# EAGLE design btle_board (EAGLE 6.6.0)
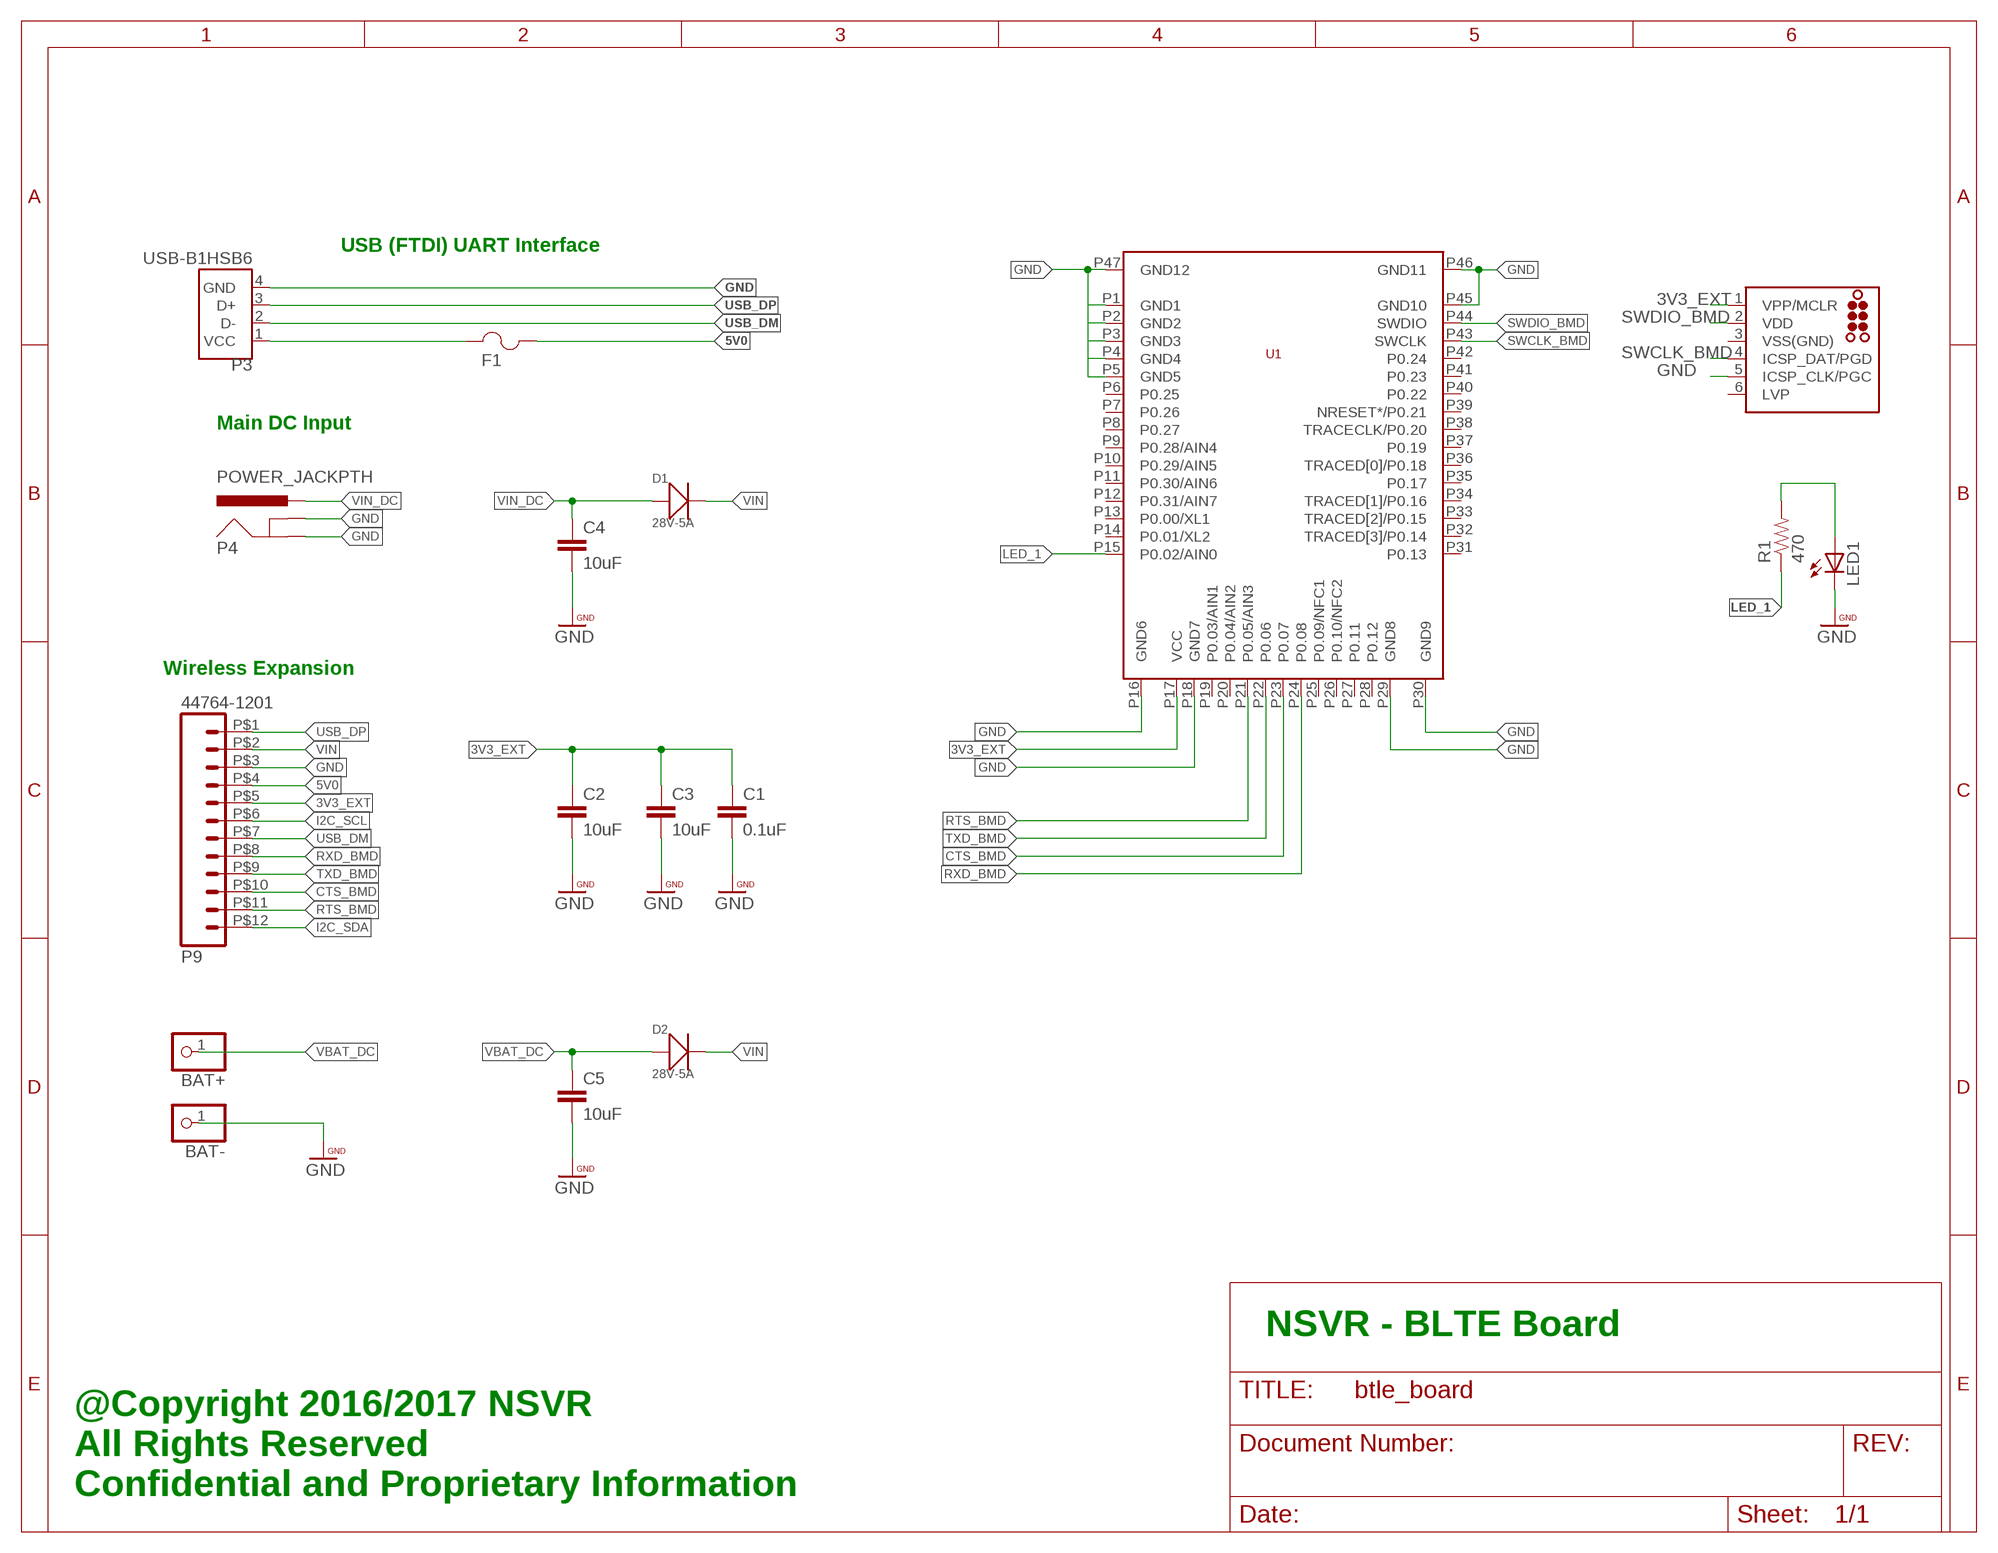
[diagram p0: schematic, sheet 1]

## Parts
BAT+  WPAD-1-PTH  [WPAD-1-PTH-2.54]
BAT-  WPAD-1-PTH  [WPAD-1-PTH-2.54]
C1  0.1uF  CAP0603-CAP  [0603-CAP]
C2  10uF  CAP0603-CAP  [0603-CAP]
C3  10uF  CAP0603-CAP  [0603-CAP]
C4  10uF  CAP0603-CAP  [0603-CAP]
C5  10uF  CAP0603-CAP  [0603-CAP]
D1  28V-5A  SMD-DIODE-SCHOTTKY-28V-5A(DO-214AA)  [DO-214AA]
D2  28V-5A  SMD-DIODE-SCHOTTKY-28V-5A(DO-214AA)  [DO-214AA]
F1  1206L050YR  [1206LSERIES]
LED1  LEDCHIP-LED0603  [CHIP-LED0603]
P1  TC2030-MCP-NL  [TC2030-MCP-NL]
P3  USB-B1HSB6  [OST_USB-B1HSB6]
P4  POWER_JACKPTH  [POWER_JACK_PTH]
P9  44764-1201  [44764-1201]
R1  470  RESISTOR0402-TYP  [EIA-0402]
U1  BMD-300  [BMD-300]

## Nets
3V3_EXT: C1.1 C2.1 C3.1 P1.1(VPP/MCLR) P9.P$5 U1.P17(VCC)
5V0: F1.2 P9.P$4
CTS_BMD: P9.P$10 U1.P23(P0.07)
GND: BAT-.1 C1.2 C2.2 C3.2 C4.2 C5.2 LED1.C P1.5(ICSP_CLK/PGC) P3.4(GND) P4.GND P4.GNDBREAK P9.P$3 U1.P1(GND1) U1.P2(GND2) U1.P3(GND3) U1.P4(GND4) U1.P5(GND5) U1.P16(GND6) U1.P18(GND7) U1.P29(GND8) U1.P30(GND9) U1.P45(GND10) U1.P46(GND11) U1.P47(GND12)
I2C_SCL: P9.P$6
I2C_SDA: P9.P$12
LED1: LED1.A R1.2
LED_1: R1.1 U1.P15(P0.02/AIN0)
RTS_BMD: P9.P$11 U1.P21(P0.05/AIN3)
RXD_BMD: P9.P$8 U1.P24(P0.08)
SWCLK_BMD: P1.4(ICSP_DAT/PGD) U1.P43(SWCLK)
SWDIO_BMD: P1.2(VDD) U1.P44(SWDIO)
TXD_BMD: P9.P$9 U1.P22(P0.06)
USB_DM: P3.2(D-) P9.P$7
USB_DP: P3.3(D+) P9.P$1
VBAT_DC: BAT+.1 C5.1 D2.+
VBUS_IN: F1.1 P3.1(VCC)
VIN: D1.- D2.- P9.P$2
VIN_DC: C4.1 D1.+ P4.PWR
Unconnected: P1.6(LVP) U1.P6(P0.25) U1.P7(P0.26) U1.P8(P0.27) U1.P9(P0.28/AIN4) U1.P10(P0.29/AIN5) U1.P11(P0.30/AIN6) U1.P12(P0.31/AIN7) U1.P13(P0.00/XL1) U1.P14(P0.01/XL2) U1.P19(P0.03/AIN1) U1.P20(P0.04/AIN2) U1.P25(P0.09/NFC1) U1.P26(P0.10/NFC2) U1.P27(P0.11) U1.P28(P0.12) U1.P31(P0.13) U1.P32(TRACED[3]/P0.14) U1.P33(TRACED[2]/P0.15) U1.P34(TRACED[1]/P0.16) U1.P35(P0.17) U1.P36(TRACED[0]/P0.18) U1.P37(P0.19) U1.P38(TRACECLK/P0.20) U1.P39(NRESET*/P0.21) U1.P40(P0.22) U1.P41(P0.23) U1.P42(P0.24)

## Notes on the sheet
- USB (FTDI) UART Interface
- Main DC Input
- Wireless Expansion
- NSVR - BLTE Board
- @Copyright 2016/2017 NSVR
  All Rights Reserved
  Confidential and Proprietary Information

## Power pins joined to a net without a drawn wire
VSS(GND): P1.3(VSS(GND))

## Library data of the parts
BAT+ BAT- = PatternAgents-ProtoPads:WPAD-1: Wire Pad - Single Good for scope lead clips, test jumpers, probe points, etc. PatternAgents ProtoPads Library Schematic and PCB layout libraries for design patterns by PatternAgents. For the CADSoft Eagle CAD program : http://www.cadsoftusa.com/download-eagle/ Source LBR : http://www.patternagents.com Github : https://github.com/PatternAgents License : http://creativecommons.org/licenses/by-sa/4.0/ (Creative Commons 4.0) THIS SOFTWARE IS PROVIDED BY THE CONTRIBUTORS "AS IS" AND WITHOUT ANY EXPRESS OR IMPLIED WARRANTIES, INCLUDING, BUT NOT LIMITED TO, THE IMPLIED WARRANTIES OF MERCHANTABILITY AND FITNESS FOR A PARTICULAR PURPOSE ARE DISCLAIMED. IN NO EVENT SHALL THE COPYRIGHT OWNER OR CONTRIBUTORS BE LIABLE FOR ANY DIRECT, INDIRECT, INCIDENTAL, SPECIAL, EXEMPLARY, OR CONSEQUENTIAL DAMAGES (INCLUDING, BUT NOT LIMITED TO, PROCUREMENT OF SUBSTITUTE GOODS OR SERVICES; LOSS OF USE, DATA, OR PROFITS; OR BUSINESS INTERRUPTION) HOWEVER CAUSED AND ON ANY THEORY OF LIABILITY, WHETHER IN CONTRACT, STRICT LIABILITY, OR TORT (INCLUDING NEGLIGENCE OR OTHERWISE) ARISING IN ANY WAY OUT OF THE USE OF THIS SOFTWARE, EVEN IF ADVISED OF THE POSSIBILITY OF SUCH DAMAGE.; BOM: EXCLUDE
C1-C5 = PatternAgents-ProtoPads:CAP: Capacitor Standard 0603 ceramic capacitor, and 0.1" leaded capacitor.
D1 D2 = Seeed-Diode-2016:SMD-DIODE-SCHOTTKY-28V-5A(DO-214AA): 304020021; MPN: SS54B
F1 = 1206L050:1206L050YR; COPYRIGHT: Copyright C 2015 Accelerated Designs. All rights reserved; MANUFACTURER_PART_NUMBER: 1206L050YR; VENDOR: Littelfuse Inc
LED1 = led:LED: LED OSRAM: - CHIPLED LG R971, LG N971, LY N971, LG Q971, LY Q971, LO R971, LY R971 LH N974, LH R974 LS Q976, LO Q976, LY Q976 LO Q996 - Hyper CHIPLED LW Q18S LB Q993, LB Q99A, LB R99A - SideLED LS A670, LO A670, LY A670, LG A670, LP A670 LB A673, LV A673, LT A673, LW A673 LH A674 LY A675 LS A676, LA A676, LO A676, LY A676, LW A676 LS A679, LY A679, LG A679 - Hyper Micro SIDELED® LS Y876, LA Y876, LO Y876, LY Y876 LT Y87S - SmartLED LW L88C, LW L88S LB L89C, LB L89S, LG L890 LS L89K, LO L89K, LY L89K LS L896, LA L896, LO L896, LY L896 - TOPLED LS T670, LO T670, LY T670, LG T670, LP T670 LSG T670, LSP T670, LSY T670, LOP T670, LYG T670 LG T671, LOG T671, LSG T671 LB T673, LV T673, LT T673, LW T673 LH T674 LS T676, LA T676, LO T676, LY T676, LB T676, LH T676, LSB T676, LW T676 LB T67C, LV T67C, LT T67C, LS T67K, LO T67K, LY T67K, LW E67C LS E67B, LA E67B, LO E67B, LY E67B, LB E67C, LV E67C, LT E67C LW T67C LS T679, LY T679, LG T679 LS T770, LO T770, LY T770, LG T770, LP T770 LB T773, LV T773, LT T773, LW T773 LH T774 LS E675, LA E675, LY E675, LS T675 LS T776, LA T776, LO T776, LY T776, LB T776 LHGB T686 LT T68C, LB T68C - Hyper Mini TOPLED® LB M676 - Mini TOPLED Santana® LG M470 LS M47K, LO M47K, LY M47K Source: http://www.osram.convergy.de LUXEON: - LUMILED® LXK2-PW12-R00, LXK2-PW12-S00, LXK2-PW14-U00, LXK2-PW14-V00 LXK2-PM12-R00, LXK2-PM12-S00, LXK2-PM14-U00 LXK2-PE12-Q00, LXK2-PE12-R00, LXK2-PE12-S00, LXK2-PE14-T00, LXK2-PE14-U00 LXK2-PB12-K00, LXK2-PB12-L00, LXK2-PB12-M00, LXK2-PB14-N00, LXK2-PB14-P00, LXK2-PB14-Q00 LXK2-PR12-L00, LXK2-PR12-M00, LXK2-PR14-Q00, LXK2-PR14-R00 LXK2-PD12-Q00, LXK2-PD12-R00, LXK2-PD12-S00 LXK2-PH12-R00, LXK2-PH12-S00 LXK2-PL12-P00, LXK2-PL12-Q00, LXK2-PL12-R00 Source: www.luxeon.com KINGBRIGHT: KA-3528ASYC Source: www.kingbright.com
P1 = tag-connect:TC2030: TAG-CONNECT ICSP Connector Manufacturer: Tag-Connect <http://www.tag-connect.com> Cable for easy In-Circuit Serial Programming. Designed for Microchip ICD2, suitable for many others. Two variants - one "with legs" (for hands-free fit on PCB) and another "without legs" for quick programming. PAD Description 1 MCLR/Vpp 2 Vdd 3 GND 4 PGD (ISPDAT) 5 PGC (ISPCLK) 6 nc (used for LVP) ©2009 ROFA.cz - modified and updated by Robert Darlington ‹rdarlington@gmail.com›
P3 = USB-B1HSB6:USB-B1HSB6: Conn Usb Type b r/a Black; AVAILABILITY: Warning; DESCRIPTION: Conn Usb Type b r/a Black; MF: On Shore Technology; MP: USB-B1HSB6; PACKAGE: None; PRICE: 0.42 USD
P4 = SparkFun-Connectors:POWER_JACK: Power Jack This is the standard 5.5mm barrel jack for power. The PTH is the most common, proven, reliable, footprint. The Slot footprint only works if the mill layer is transmitted to the PCB fab house so be warned. Mating wall wart : TOL-00298 (and others); PROD_ID: CONN-08197
P9 = nsvr:44764-1201
R1 = PatternAgents-ProtoPads:RESISTOR: Resistor Basic schematic elements and footprints for 0603, 1206, and PTH resistors.
U1 = BMD-300:BMD-300

## Board
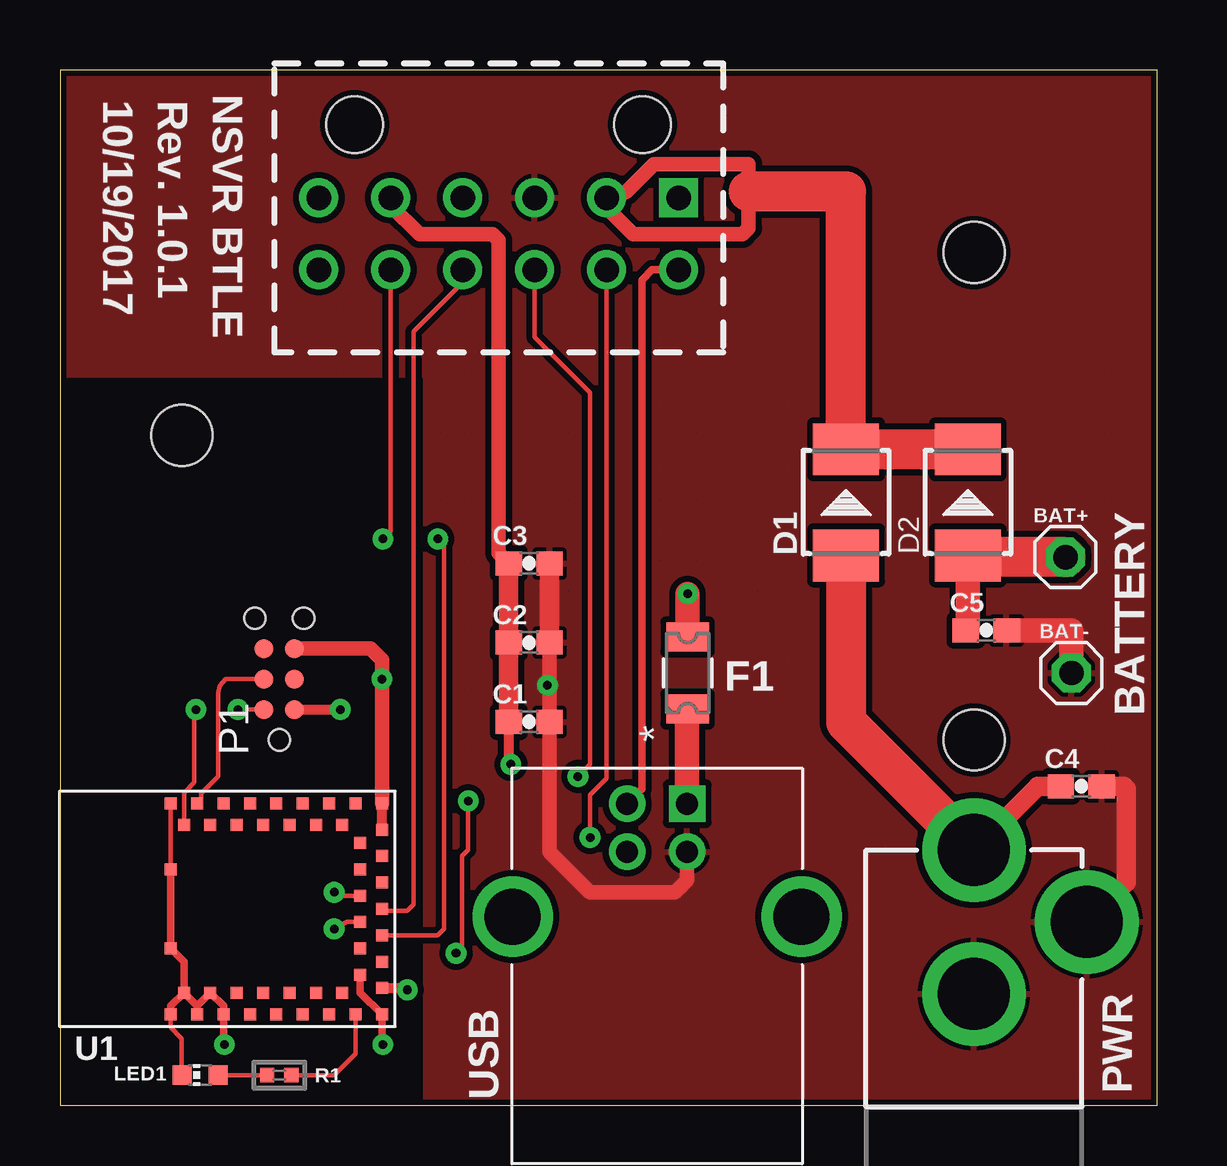
[diagram p1: board, top side]
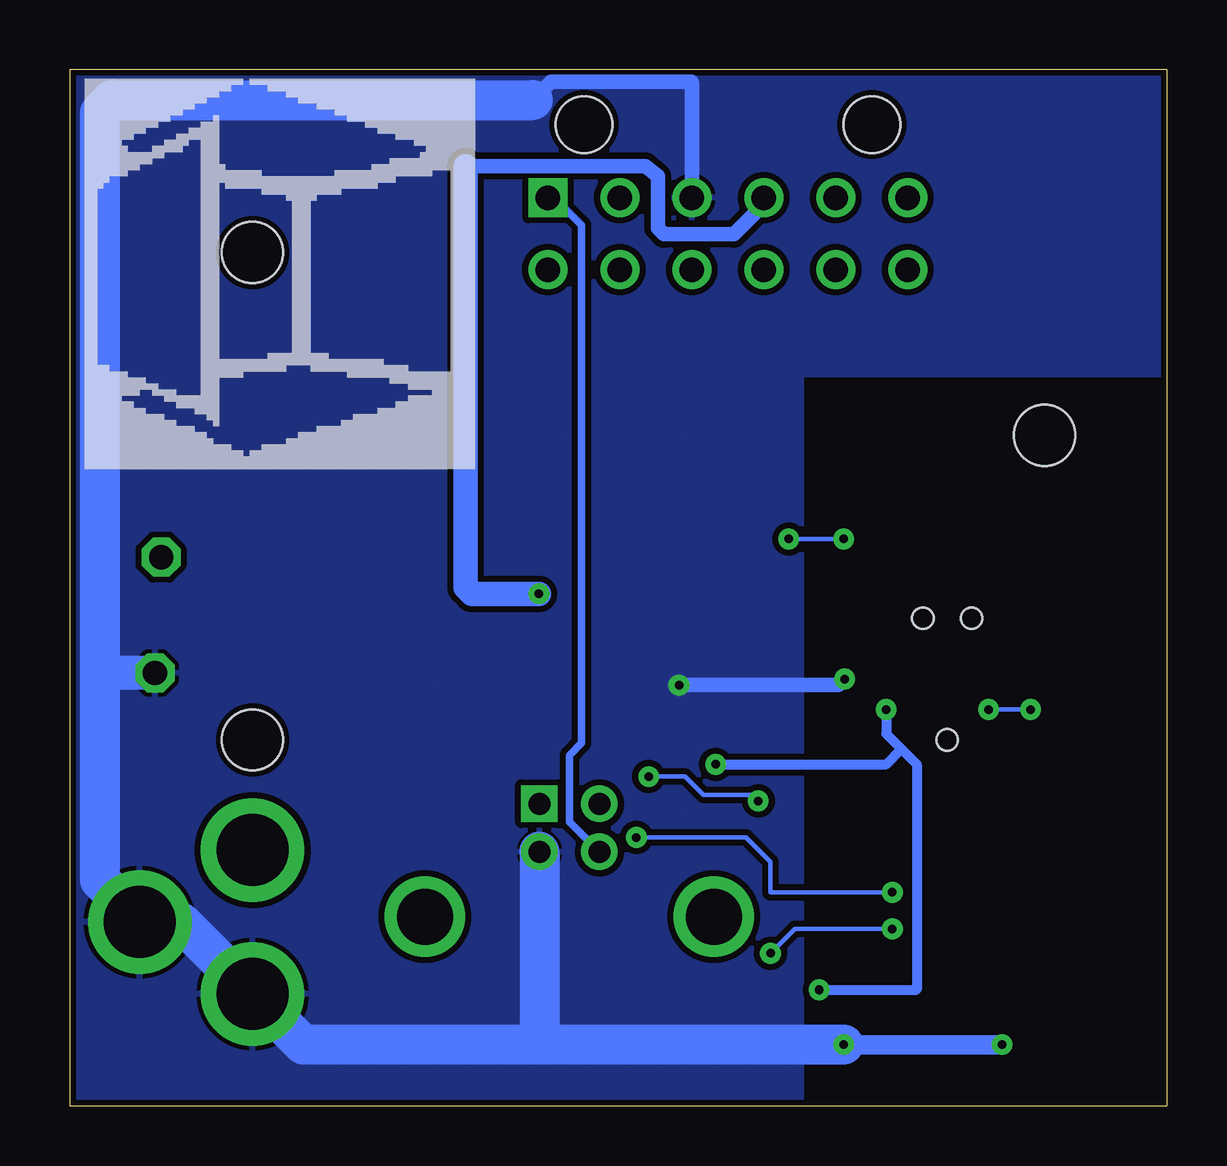
[diagram p2: board, bottom side, seen from below]

Size 45.72 x 43.18 mm. Coordinates in mm from the lower left corner, seen from the top.
Outline: 0,43.18 0,0 45.72,0 45.72,43.18 0,43.18
Copper layers (1*16): Top 0.035mm / dielectric 1.5mm / Bottom 0.035mm
Design rules "PatternAgents_7mil": minimum track width 7mil, minimum drill 14mil, track to track 7mil, track to pad 7mil, pad to pad 7mil, via to via 7mil, smd to smd 7mil, copper to edge 7mil, drill to drill 7mil, minimum pad ring 12mil, minimum via ring 10mil, stop-mask expansion 4mil, vias tented up to drill 25mil, thermal gap 7mil
Holes 2.54 mm at 38.1,35.56 5.08,27.94 38.1,15.24

### Footprints (pad centres in the part's own frame; a part is rotated, then mirrored left to right if it is on the bottom)
WPAD-1-PTH-2.54 = drill 1.016 octagon: 1 0,0
0603-CAP = smd 1.1 x 1: 1 -0.85,0; 2 0.85,0
DO-214AA = smd 2.159 x 2.743: + -2.21,0; - 2.21,0
1206LSERIES = smd 1.219 x 1.778: 1 -1.499,0; 2 1.499,0
CHIP-LED0603 = smd 0.8 x 0.8: A 0,-0.75; C 0,0.75
TC2030-MCP-NL = smd 0.787 x 0.787: 1 1.27,-0.635; 2 1.27,0.635; 3 2.54,-0.635; 4 2.54,0.635; 5 3.81,-0.635; 6 3.81,0.635 | hole 0.889: 0,0; 5.08,-1.016; 5.08,1.016
OST_USB-B1HSB6 = drill 0.92 square: 1 1.25,4.71 | drill 0.92: 2 -1.25,4.71; 3 -1.25,2.71; 4 1.25,2.71 | drill 2.33: P1 -6.02,0; P2 6.02,0
POWER_JACK_PTH = drill 2.997 pad 4.318: GND 0,7.7; GNDBREAK 4.7,10.7; PWR 0,13.7
44764-1201 = drill 1.02 square: P$1 -7.5,0 | drill 1.02: P$2 -4.5,0; P$3 -1.5,0; P$4 1.5,0; P$5 4.5,0; P$6 7.5,0; P$7 -7.5,3; P$8 -4.5,3; P$9 -1.5,3; P$10 1.5,3; P$11 4.5,3; P$12 7.5,3 | hole 2.36: -6,-3.05; 6,-3.05
EIA-0402 = smd 0.6 x 0.6: 1 -0.508,0; 2 0.508,0
BMD-300 = smd 0.5 x 0.5: P1 0.5,9.35; P2 1.4,8.8; P3 0.5,8.25; P4 1.4,7.7; P5 0.5,7.15; P6 1.4,6.6; P7 0.5,6.05; P8 1.4,5.5; P9 0.5,4.95; P10 1.4,4.4; P11 0.5,3.85; P12 1.4,3.3; P13 0.5,2.75; P14 1.4,2.2; P15 0.5,1.65; P16 0.5,0.55; P17 1.6,0.55; P18 2.15,1.45; P19 2.7,0.55; P20 3.25,1.45; P21 3.8,0.55; P22 4.35,1.45; P23 4.9,0.55; P24 5.45,1.45; P25 6,0.55; P26 6.55,1.45; P27 7.1,0.55; P28 7.65,1.45; P29 8.2,0.55; P30 9.3,0.55; P31 9.3,1.65; P32 8.4,2.2; P33 9.3,2.75; P34 8.4,3.3; P35 9.3,3.85; P36 8.4,4.4; P37 9.3,4.95; P38 8.4,5.5; P39 9.3,6.05; P40 8.4,6.6; P41 9.3,7.15; P42 8.4,7.7; P43 9.3,8.25; P44 8.4,8.8; P45 9.3,9.35; P46 6.55,9.35; P47 3.25,9.35

### Placement (x,y rotation side)
BAT+  41.91,22.86 0 top
BAT-  42.16,18.03 0 top
C1  19.56,16 0 top
C2  19.56,19.3 0 top
C3  19.56,22.61 0 top
C4  42.57,13.31 0 top
C5  38.61,19.81 0 top
D1  32.77,25.15 90 top
D2  37.85,25.15 90 top
F1  26.16,18.03 90 top
LED1  5.84,1.27 90 top
P1  9.14,15.24 90 top
P3  24.89,7.87 0 top
P4  38.1,-3.05 0 top
P9  18.29,37.85 180 top
R1  9.14,1.27 180 top
U1  13.97,3.3 90 top
U$6  [NSVR_LOGO]  44.96,26.67 0 bottom

### Tracks (layer width: path | path; a pad name or v marks a point on that pad's centre or on a via)
3V3_EXT  (via drill 0.36)
  Top 0.406: U1.P17 14.4,4.9 v14.48,4.83 | P1.1 v11.68,16.51 | C1.1 18.71,14.31 v18.8,14.22
  Top 0.61: P9.P$5 13.79,37.52 14.99,36.32 18.03,36.32 18.29,36.07 18.29,23.03 C3.1
  Top 0.813: C3.1 C2.1 C1.1
  Bottom 0.406: v14.48,4.83 10.41,4.83 10.41,14.22 11.05,14.86 | v11.68,16.51 11.68,15.49 11.05,14.86 | v18.8,14.22 11.68,14.22 11.05,14.86
5V0  (via drill 0.36)
  Top 1.016: v26.16,21.34 F1.2
  Bottom 0.61: P9.P$4 16.79,37.57 18.03,36.32 20.95,36.32 21.21,36.58 21.21,38.73 21.72,39.17 29.21,39.17 29.26,39.17
  Bottom 1.016: v26.16,21.34 28.96,21.34 29.21,21.59 29.21,39.17
CTS_BMD
  Top 0.178: U1.P23 13.49,8.13 14.48,8.13 14.73,8.38 14.73,32.26 16.79,34.31 P9.P$10
GND  (via drill 0.36)
  Top 0.178: U1.P46 U1.P45 | U1.P1 4.62,3.25 5.08,2.79 5.08,1.28 LED1.C
  Top 0.305: U1.P46 U1.P47 5.17,6 U1.P2 | 5.72,4.15 U1.P2 | U1.P1 4.62,4.15 U1.P2 | U1.P3 5.72,4.15 | 5.72,4.15 U1.P4 6.82,4.15 U1.P5 6.82,2.58 v6.86,2.54 | v13.46,2.54 13.42,2.58 U1.P16 12.52,4.7 U1.P18
  Top 0.406: U1.P29 U1.P30
  Top 0.61: P3.4 26.14,9.4 25.63,8.89 22.1,8.89 20.41,10.58 C1.2 20.41,17.44 v20.32,17.53 20.41,17.61 C2.2 | U1.P30 v13.42,17.78 13.42,18.58 12.95,19.05 P1.5
  Top 0.813: C2.2 C3.2 | C4.2 44.35,13.31 44.45,13.21 44.45,9.3 P4.GNDBREAK
  Top 1.016: C5.2 42.16,19.81 BAT-.1
  Bottom 0.61: P9.P$3 19.79,42.65 19.81,42.67 25.65,42.67 26.42,41.91 | v20.32,17.53 13.67,17.53 v13.42,17.78
  Bottom 0.813: v6.86,2.54 v13.46,2.54
  Bottom 1.422: BAT-.1 44.45,18.03
  Bottom 1.676: 26.42,41.91 43.94,41.91 44.45,41.4 44.45,18.03 44.45,9.4 42.8,7.75 P4.GNDBREAK 41.1,7.65 P4.GND 35.99,2.54 26.16,2.54 | v13.46,2.54 26.16,2.54 | P3.4 26.14,2.56 26.16,2.54
  pour Top (isolate 0.254, hatched): 15.24,0 45.72,0 45.72,43.18 0,43.18 0,30.48 15.24,30.48
  pour Bottom (isolate 0.254, hatched): 15.24,0 45.72,0 45.72,43.18 0,43.18 0,30.48 15.24,30.48
LED1
  Top 0.178: LED1.A R1.2
LED_1
  Top 0.178: U1.P15 12.32,2.16 11.43,1.27 R1.1
RTS_BMD  (via drill 0.36)
  Top 0.178: U1.P21 15.74,7.1 16,7.37 16,23.37 v15.75,23.62 | P9.P$11 13.79,23.95 v13.46,23.62
  Bottom 0.178: v15.75,23.62 v13.46,23.62
RXD_BMD  (via drill 0.36)
  Top 0.178: U1.P24 11.57,8.75 v11.43,8.89 | P9.P$8 22.79,13.64 22.1,12.95 v22.1,11.18
  Bottom 0.178: v11.43,8.89 16.51,8.89 16.51,10.16 17.53,11.18 v22.1,11.18
SWCLK_BMD
  Top 0.178: P1.4 6.91,17.78 6.66,17.5 6.6,17.2 6.6,13.72 5.89,13.01 5.89,12.78 U1.P43 5.84,12.72
SWDIO_BMD  (via drill 0.36)
  Top 0.178: 5.93,16.5 v5.66,16.51 5.59,16.18 5.59,13.46 5.17,13.04 U1.P44 | v7.42,16.51 P1.2
  Bottom 0.178: v5.66,16.51 v7.42,16.51
TXD_BMD  (via drill 0.36)
  Top 0.178: U1.P22 11.97,7.65 v11.43,7.37 | P9.P$9 19.79,32.03 22.1,29.72 22.1,14.22 v21.59,13.72 | v17.02,12.7 17.02,10.67 16.76,10.41 16.76,6.6 v16.51,6.35
  Bottom 0.178: v11.43,7.37 15.49,7.37 v16.51,6.35 | v21.59,13.72 20.07,13.72 19.3,12.95 17.27,12.95 v17.02,12.7
USB_DM
  Top 0.305: P9.P$7 24.69,34.85 24.26,34.42 24.26,13.2 P3.2
USB_DP
  Bottom 0.305: P9.P$1 25.53,37.85 24.38,36.7 24.38,15.11 24.89,14.61 24.89,11.83 P3.3
VBAT_DC
  Top 1.016: C5.1 37.85,19.81 D2.+
  Top 1.676: BAT+.1 37.85,22.86 D2.+
VBUS_IN
  Top 1.016: P3.1 26.14,16.52 F1.1
VIN
  Top 0.61: 22.86,37.85 22.86,37.34 23.88,36.32 28.45,36.32 28.7,36.58 28.7,38.1 28.7,39.24 24.77,39.24 23.62,38.1 23.04,37.85 P9.P$2
  Top 1.676: 28.7,38.1 32.77,38.1 D1.- D2.-
VIN_DC
  Top 0.813: C4.1 40.76,13.31 P4.PWR
  Top 1.676: D1.+ 32.77,15.99 P4.PWR

### Text on the board
tPlace: 10/19/2017 | Rev. 1.0.1 | NSVR BTLE | F1 | BATTERY | PWR | USB